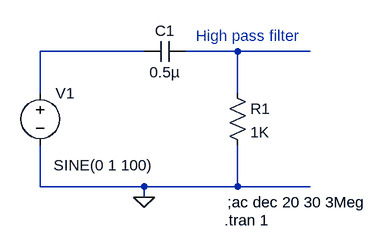
[diagram p0: schematic sch.asc]
sch.asc, the LTspice schematic file:
Version 4
SHEET 1 880 680
WIRE 144 64 -16 64
WIRE 288 64 208 64
WIRE 400 64 288 64
WIRE -16 128 -16 64
WIRE 288 128 288 64
WIRE -16 272 -16 208
WIRE 144 272 -16 272
WIRE 288 272 288 208
WIRE 288 272 144 272
WIRE 400 272 288 272
WIRE 144 288 144 272
FLAG 144 288 0
SYMBOL res 272 112 R0
SYMATTR InstName R1
SYMATTR Value 1K
SYMBOL cap 208 48 R90
WINDOW 0 0 32 VBottom 2
WINDOW 3 32 32 VTop 2
SYMATTR InstName C1
SYMATTR Value 0.5µ
SYMBOL voltage -16 112 R0
WINDOW 3 21 127 Left 2
WINDOW 123 24 124 Left 2
WINDOW 39 0 0 Left 0
SYMATTR InstName V1
SYMATTR Value SINE(0 1 100)
TEXT 272 296 Left 2 !;ac dec 20 30 3Meg
TEXT 268 324 Left 2 !.tran 1
TEXT 224 40 Left 2 ;High pass filter

The netlist it stands for:
* sch.asc
R1 N002 0 1K
C1 N002 N001 0.5µ
V1 N001 0 SINE(0 1 100)
;ac dec 20 30 3Meg
.tran 1
* High pass filter
.backanno
.end